# Altium schematic sheet analog_channel.SchDoc
size A4; SheetNumber: 3; SheetTotal: 5
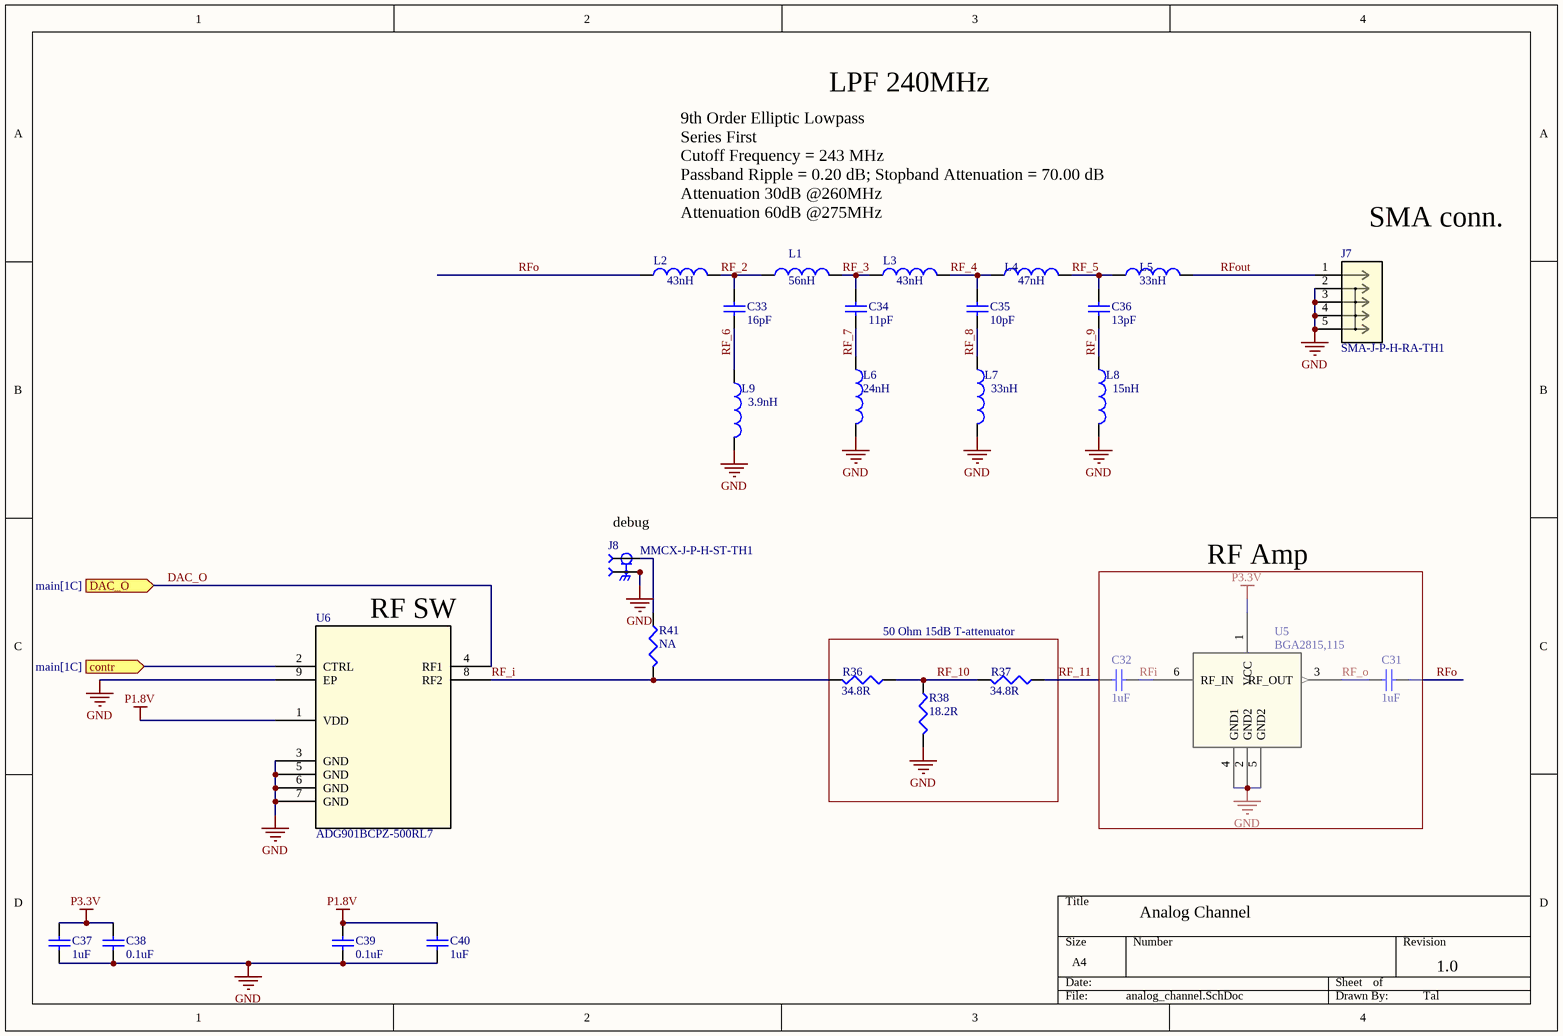
[diagram p0: analog_channel.SchDoc]

## Parts
C31  Capacitance: 1uF  [C0402]  (hidden comment: 1uF 25V)
C32  Capacitance: 1uF  [C0402]  (hidden comment: 1uF 25V)
C33  Capacitance: 16pF  [C0402]  (hidden comment: 16pF 50V)
C34  Capacitance: 11pF  [C0402]  (hidden comment: 11pF 50V)
C35  Capacitance: 10pF  [C0402]  (hidden comment: 10pF 50V)
C36  Capacitance: 13pF  [C0402]  (hidden comment: 13pF 50V)
C37  Capacitance: 1uF  [C0402]  (hidden comment: 1uF 25V)
C38  Capacitance: 0.1uF  [C0402]  (hidden comment: 0.1uF 50V)
C39  Capacitance: 0.1uF  [C0402]  (hidden comment: 0.1uF 50V)
C40  Capacitance: 1uF  [C0402]  (hidden comment: 1uF 25V)
J7  SMA-J-P-H-RA-TH1  [CONN_SMA-J-P-H-RA-TH1_SAI]
J8  MMCX-J-P-H-ST-TH1  [SAMTEC_MMCX-J-P-H-ST-TH1]
L1  value 56nH  [0402-A]  (hidden comment: Inductor)
L2  value 43nH  [0402-A]  (hidden comment: Inductor)
L3  value 43nH  [0402-A]  (hidden comment: Inductor)
L4  value 47nH  [0402-A]  (hidden comment: Inductor)
L5  value 33nH  [0402-A]  (hidden comment: Inductor)
L6  value 24nH  [0402-A]  (hidden comment: Inductor)
L7  value 33nH  [0402-A]  (hidden comment: Inductor)
L8  value 15nH  [0402-A]  (hidden comment: Inductor)
L9  value 3.9nH  [0402-A]  (hidden comment: Inductor)
R36  34.8R  [r0402]
R37  34.8R  [r0402]
R38  18.2R  [r0402]
R41  NA  [r0402]
U5  BGA2815,115  [SOT_2815,115_NXP]
U6  ADG901BCPZ-500RL7  [CP_8_2_ADI]

## Blocks framed on the sheet
RF Amp: C31 C32 U5
50 Ohm 15dB T-attenuator: R36-R38

## Ports
contr (in, see main[1C]), DAC_O (in, see main[1C])

## Nets
GND: C37.1 C38.1 C39.1 C40.1 J7.2 J7.3 J7.4 J7.5 J8.S1 J8.S2 J8.S3 J8.S4 L6.2 L7.2 L8.2 L9.2 R38.2 U5.2(GND2) U5.4(GND1) U5.5(GND2) U6.3(GND) U6.5(GND) U6.6(GND) U6.7(GND) U6.9(EP)
P1.8V: C39.2 C40.2 U6.1(VDD)
P3.3V: C37.2 C38.2 U5.1(VCC)
contr: U6.2(CTRL) ; port contr
DAC_O: U6.4(RF1) ; port DAC_O
RF_2: C33.1 L1.1 L2.2
RF_3: C34.1 L1.2 L3.1
RF_4: C35.1 L3.2 L4.1
RF_5: C36.1 L4.2 L5.1
RF_6: C33.2 L9.1
RF_7: C34.2 L6.1
RF_8: C35.2 L7.1
RF_9: C36.2 L8.1
RF_10: R36.1 R37.2 R38.1
RF_11: C32.1 R37.1
RF_i: R36.2 R41.2 U6.8(RF2)
RF_o: C31.1 U5.3(RF_OUT)
RFi: C32.2 U5.6(RF_IN)
RFo: C31.2 L2.1
RFout: J7.1 L5.2
NetJ8_1: J8.1 R41.1

## Notes on the sheet
- LPF 240MHz
- 9th Order Elliptic Lowpass
  Series First
  Cutoff Frequency = 243 MHz
  Passband Ripple = 0.20 dB; Stopband Attenuation = 70.00 dB
  Attenuation 30dB @260MHz
  Attenuation 60dB @275MHz
- (near J7) SMA conn.
- (near J8) debug
- (near U6) RF SW
- Analog Channel
- 1.0
- Tal

## Library data of the parts
C31 C32 C37 C40 = CAP CER 6.8pF 50V NP0 0402: CAP CER 1uF 25V X5R 0402; Manufacturer Part Number: C1005C0G1H6R8D; Manufacturer: TDK Corporation; LANDA P/N: ECP-000033; Voltage - Rated: 50V; RoHS: RoHS Compliant; Package / Case: 0402 (1005 Metric); ComponentLink1URL: http://www.tdk.com/pdf/general_B11.pdf; ComponentLink1Description: http://www.tdk.com/pdf/general_B11.pdf
C33 = CAP CER 20pF 50V 5% NP0 0402: CAP CER 16PF 50V 5% NP0 0402; Manufacturer: TDK Corporation; Manufacturer Part Number: C1005C0G1H200J; LANDA P/N: ECP-000034; Package / Case: 0402 (1005 Metric); RoHS: RoHS Compliant; ComponentLink1URL: http://www.tdk.com/pdf/general_B11.pdf; ComponentLink1Description: http://www.tdk.com/pdf/general_B11.pdf; Voltage - Rated: 50V
C34 = CAP CER 20pF 50V 5% NP0 0402: CAP CER 11PF 50V 5% NP0 0402; Manufacturer: TDK Corporation; Manufacturer Part Number: C1005C0G1H200J; LANDA P/N: ECP-000034; Package / Case: 0402 (1005 Metric); RoHS: RoHS Compliant; ComponentLink1URL: http://www.tdk.com/pdf/general_B11.pdf; ComponentLink1Description: http://www.tdk.com/pdf/general_B11.pdf; Voltage - Rated: 50V
C35 = CAP CER 20pF 50V 5% NP0 0402: CAP CER 10PF 50V 5% NP0 0402; Manufacturer: TDK Corporation; Manufacturer Part Number: C1005C0G1H200J; LANDA P/N: ECP-000034; Package / Case: 0402 (1005 Metric); RoHS: RoHS Compliant; ComponentLink1URL: http://www.tdk.com/pdf/general_B11.pdf; ComponentLink1Description: http://www.tdk.com/pdf/general_B11.pdf; Voltage - Rated: 50V
C36 = CAP CER 20pF 50V 5% NP0 0402: CAP CER 13PF 50V 5% NP0 0402; Manufacturer: TDK Corporation; Manufacturer Part Number: C1005C0G1H200J; LANDA P/N: ECP-000034; Package / Case: 0402 (1005 Metric); RoHS: RoHS Compliant; ComponentLink1URL: http://www.tdk.com/pdf/general_B11.pdf; ComponentLink1Description: http://www.tdk.com/pdf/general_B11.pdf; Voltage - Rated: 50V
C38 C39 = CAP CER 6.8pF 50V NP0 0402: CAP CER 0.1uF 50V NP0 0402; Manufacturer Part Number: C1005C0G1H6R8D; Manufacturer: TDK Corporation; LANDA P/N: ECP-000033; RoHS: RoHS Compliant; Package / Case: 0402 (1005 Metric); ComponentLink1URL: http://www.tdk.com/pdf/general_B11.pdf; ComponentLink1Description: http://www.tdk.com/pdf/general_B11.pdf; Voltage - Rated: 50V
J7 = SMA-J-P-H-RA-TH1: No Description Available; Mfr_Name: Samtec Inc; Copyright: Copyright (C) 2023 Ultra Librarian. All rights reserved.; Manufacturer_Part_Number: SMA-J-P-H-RA-TH1; RefDes: RefDes; Type: DEV
J8 = MMCX-J-P-H-ST-TH1: MMCX STRAIGHT, THROUGH HOLE JACK- 50 OHM; MF: Samtec; MP: MMCX-J-P-H-ST-TH1; Price: None; Package: None; Value: *; Availability: Unavailable
L1-L9 = Inductor: Code_IEC: 1005; Published: 8-Jun-2000; LatestRevisionDate: 29-May-2009; LatestRevisionNote: IPC-7351 Footprint Added.; PackageReference: 0402-A; Publisher: Altium Limited; PackageDescription: Chip Inductor; Code_JEITA: 0402
R36 R37 = RES 100 OHM 1/10W 1% 0402 SMD: RES 34.8 OHM 1/10W 1% 0402 SMD; Manufacturer Part Number: ERJ-2RKF1000X; Manufacturer: Panasonic Electronic Components; LANDA P/N: ERS-000079; Assembly: N.C; Package / Case: 0402 (1005 Metric); RoHS: RoHS Compliant; ComponentLink1URL: http://industrial.panasonic.com/www-cgi/jvcr13pz.cgi?E+PZ+3+AOA0002+ERJ2RKF1000X+7+WW; ComponentLink1Description: http://industrial.panasonic.com/www-cgi/jvcr13pz.cgi?E+PZ+3+AOA0002+ERJ2RKF1000X+7+WW; Supplier Device Package: 0402
R38 = RES 100 OHM 1/10W 1% 0402 SMD: RES 18.2 OHM 1/10W 1% 0402 SMD; Manufacturer Part Number: ERJ-2RKF1000X; Manufacturer: Panasonic Electronic Components; LANDA P/N: ERS-000079; Assembly: N.C; Package / Case: 0402 (1005 Metric); RoHS: RoHS Compliant; ComponentLink1URL: http://industrial.panasonic.com/www-cgi/jvcr13pz.cgi?E+PZ+3+AOA0002+ERJ2RKF1000X+7+WW; ComponentLink1Description: http://industrial.panasonic.com/www-cgi/jvcr13pz.cgi?E+PZ+3+AOA0002+ERJ2RKF1000X+7+WW; Supplier Device Package: 0402
R41 = RES 100 OHM 1/10W 1% 0402 SMD: RES 0 OHM 1/10W 1% 0402 SMD; Manufacturer Part Number: ERJ-2RKF1000X; Manufacturer: Panasonic Electronic Components; LANDA P/N: ERS-000079; Assembly: N.C; Package / Case: 0402 (1005 Metric); RoHS: RoHS Compliant; ComponentLink1URL: http://industrial.panasonic.com/www-cgi/jvcr13pz.cgi?E+PZ+3+AOA0002+ERJ2RKF1000X+7+WW; ComponentLink1Description: http://industrial.panasonic.com/www-cgi/jvcr13pz.cgi?E+PZ+3+AOA0002+ERJ2RKF1000X+7+WW; Supplier Device Package: 0402
U5 = BGA2815,115: No Description Available; Mfr_Name: NXP; Copyright: Copyright (C) 2023 Ultra Librarian. All rights reserved.; Manufacturer_Part_Number: BGA2815,115; RefDes: RefDes; Type: DEV
U6 = ADG901BCPZ-500RL7: No Description Available; Mfr_Name: Analog Devices Inc; Copyright: Copyright (C) 2023 Ultra Librarian. All rights reserved.; Manufacturer_Part_Number: ADG901BCPZ-500RL7; RefDes: RefDes; Type: DEV